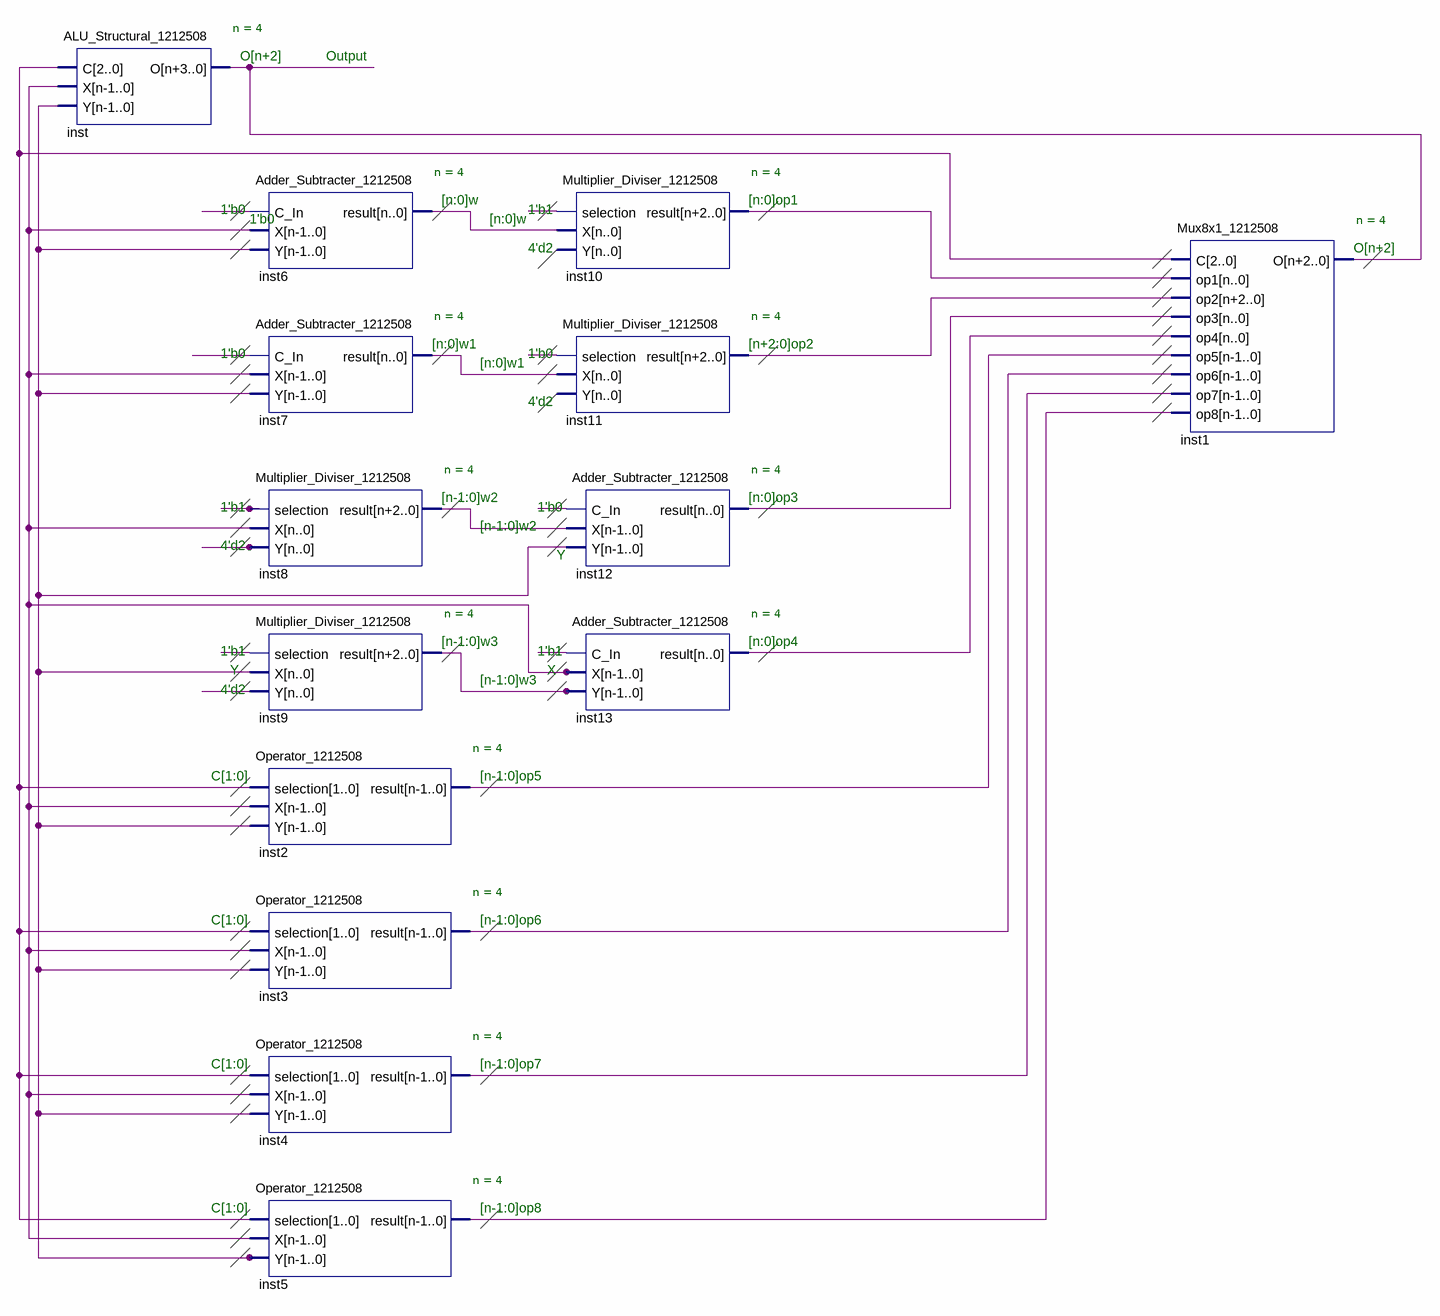
[diagram p0: schematic sheet]
// Quartus schematic MSI_1212508.bdf as structural Verilog: 14 symbols, 0 pins
module MSI_1212508 (
);

  wire inst2_result, inst3_result, inst4_result, inst5_result, inst6_result, inst7_result, inst8_result,
       inst9_result, inst10_result, inst11_result, inst12_result, inst13_result, inst_o, undriven,
       undriven_2, undriven_3, undriven_4, undriven_5, undriven_6, undriven_7, undriven_8, undriven_9,
       undriven_10, undriven_11, undriven_12, undriven_13;

  ALU_Structural_1212508 #(.n(4)) inst (.C({3{undriven_11}}), .X({4{undriven_12}}), .Y({4{undriven_13}}), .O(inst_o));
  Adder_Subtracter_1212508 #(.n(4)) inst6 (
    .C_In(undriven_10), .X({4{undriven_12}}), .Y({4{undriven_13}}), .result(inst6_result));
  Adder_Subtracter_1212508 #(.n(4)) inst7 (
    .C_In(undriven_9), .X({4{undriven_12}}), .Y({4{undriven_13}}), .result(inst7_result));
  Multiplier_Diviser_1212508 #(.n(4)) inst8 (
    .selection(undriven_2), .X({5{undriven_12}}), .Y({5{undriven_8}}), .result(inst8_result));
  Multiplier_Diviser_1212508 #(.n(4)) inst9 (
    .selection(undriven), .X({5{undriven_13}}), .Y({5{undriven_7}}), .result(inst9_result));
  Operator_1212508 #(.n(4)) inst2 (
    .selection({2{undriven_11}}), .X({4{undriven_12}}), .Y({4{undriven_13}}), .result(inst2_result));
  Operator_1212508 #(.n(4)) inst3 (
    .selection({2{undriven_11}}), .X({4{undriven_12}}), .Y({4{undriven_13}}), .result(inst3_result));
  Operator_1212508 #(.n(4)) inst4 (
    .selection({2{undriven_11}}), .X({4{undriven_12}}), .Y({4{undriven_13}}), .result(inst4_result));
  Operator_1212508 #(.n(4)) inst5 (
    .selection({2{undriven_11}}), .X({4{undriven_12}}), .Y({4{undriven_13}}), .result(inst5_result));
  Multiplier_Diviser_1212508 #(.n(4)) inst10 (
    .selection(undriven_3), .X({5{inst6_result}}), .result(inst10_result));  // open: Y
  Multiplier_Diviser_1212508 #(.n(4)) inst11 (
    .selection(undriven_4), .X({5{inst7_result}}), .result(inst11_result));  // open: Y
  Adder_Subtracter_1212508 #(.n(4)) inst12 (
    .C_In(undriven_5), .X({4{inst8_result}}), .Y({4{undriven_13}}), .result(inst12_result));
  Adder_Subtracter_1212508 #(.n(4)) inst13 (
    .C_In(undriven_6), .X({4{undriven_12}}), .Y({4{inst9_result}}), .result(inst13_result));
  Mux8x1_1212508 #(.n(4)) inst1 (
    .C({3{undriven_11}}), .op1({5{inst10_result}}), .op2({7{inst11_result}}), .op3({5{inst12_result}}),
    .op4({5{inst13_result}}), .op5({4{inst2_result}}), .op6({4{inst3_result}}), .op7({4{inst4_result}}),
    .op8({4{inst5_result}}), .O(inst_o));

  // Notes on the sheet:
  //   O[n+2]
  //   Output
  //   [n:0]w
  //   [n:0]op1
  //   1'b0
  //   1'b1
  //   1'b0
  //   [n:0]w
  //   4'd2
  //   O[n+2]
  //   [n:0]w1
  //   [n+2:0]op2
  //   1'b0
  //   1'b0
  //   [n:0]w1
  //   4'd2
  //   [n-1:0]w2
  //   [n:0]op3
  //   1'b1
  //   1'b0
  //   [n-1:0]w2
  //   4'd2
  //   Y
  //   [n-1:0]w3
  //   [n:0]op4
  //   1'b1
  //   1'b1
  //   Y
  //   X
  //   [n-1:0]w3
  //   4'd2
  //   C[1:0]
  //   [n-1:0]op5
  //   C[1:0]
  //   [n-1:0]op6
  //   C[1:0]
  //   [n-1:0]op7
  //   C[1:0]
  //   [n-1:0]op8
endmodule
